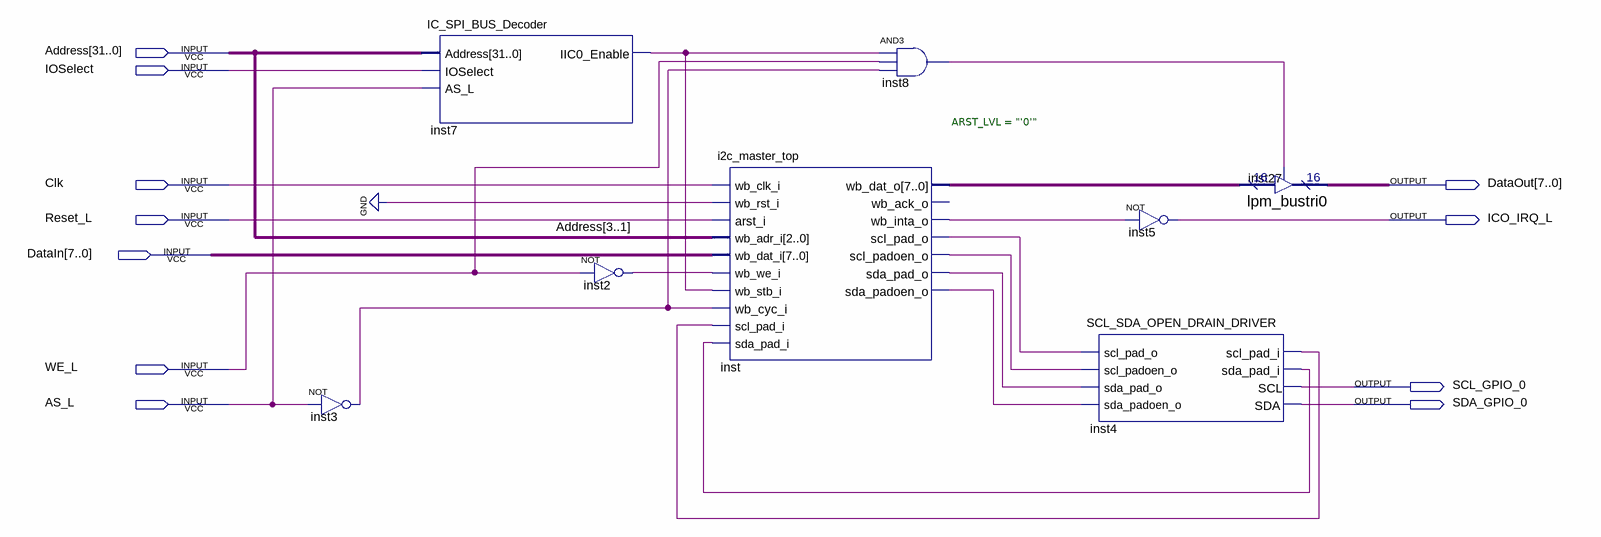
[diagram p0: schematic sheet]
// Quartus schematic IIC.bdf as structural Verilog: 8 symbols, 11 pins
module IIC (
  input  [31:0] Address,
  input  IOSelect,
  input  Clk,
  input  Reset_L,
  input  [7:0] DataIn,
  input  WE_L,
  input  AS_L,
  output [7:0] DataOut,
  output ICO_IRQ_L,
  output SCL_GPIO_0,
  output SDA_GPIO_0
);

  wire inst2_out, inst3_out, inst4_scl_pad_i, inst4_sda_pad_i, inst7_iic0_enable, inst8_out, inst_scl_pad_o,
       inst_scl_padoen_o, inst_sda_pad_o, inst_sda_padoen_o, inst_wb_inta_o;
  wire [15:0] inst_wb_dat_o;

  not inst3 (inst3_out, AS_L);
  IC_SPI_BUS_Decoder inst7 (.Address(Address), .IOSelect(IOSelect), .AS_L(AS_L), .IIC0_Enable(inst7_iic0_enable));
  not inst2 (inst2_out, WE_L);
  i2c_master_top #(.ARST_LVL("'0'")) inst (
    .wb_clk_i(Clk), .wb_rst_i(1'b0), .arst_i(Reset_L), .wb_adr_i(Address[3:1]), .wb_dat_i(DataIn),
    .wb_we_i(inst2_out), .wb_stb_i(inst7_iic0_enable), .wb_cyc_i(inst3_out), .scl_pad_i(inst4_scl_pad_i),
    .sda_pad_i(inst4_sda_pad_i), .wb_dat_o(inst_wb_dat_o), .wb_inta_o(inst_wb_inta_o),
    .scl_pad_o(inst_scl_pad_o), .scl_padoen_o(inst_scl_padoen_o), .sda_pad_o(inst_sda_pad_o),
    .sda_padoen_o(inst_sda_padoen_o));  // open: wb_ack_o
  and inst8 (inst8_out, inst7_iic0_enable, WE_L, inst3_out);
  not inst5 (ICO_IRQ_L, inst_wb_inta_o);
  SCL_SDA_OPEN_DRAIN_DRIVER inst4 (
    .scl_pad_o(inst_scl_pad_o), .scl_padoen_o(inst_scl_padoen_o), .sda_pad_o(inst_sda_pad_o),
    .sda_padoen_o(inst_sda_padoen_o), .scl_pad_i(inst4_scl_pad_i), .sda_pad_i(inst4_sda_pad_i),
    .SCL(SCL_GPIO_0), .SDA(SDA_GPIO_0));
  lpm_bustri0 inst27 (.enabledt(inst8_out), .data(inst_wb_dat_o), .tridata(DataOut));
endmodule
